# Altium project AMX3.PrjPCB
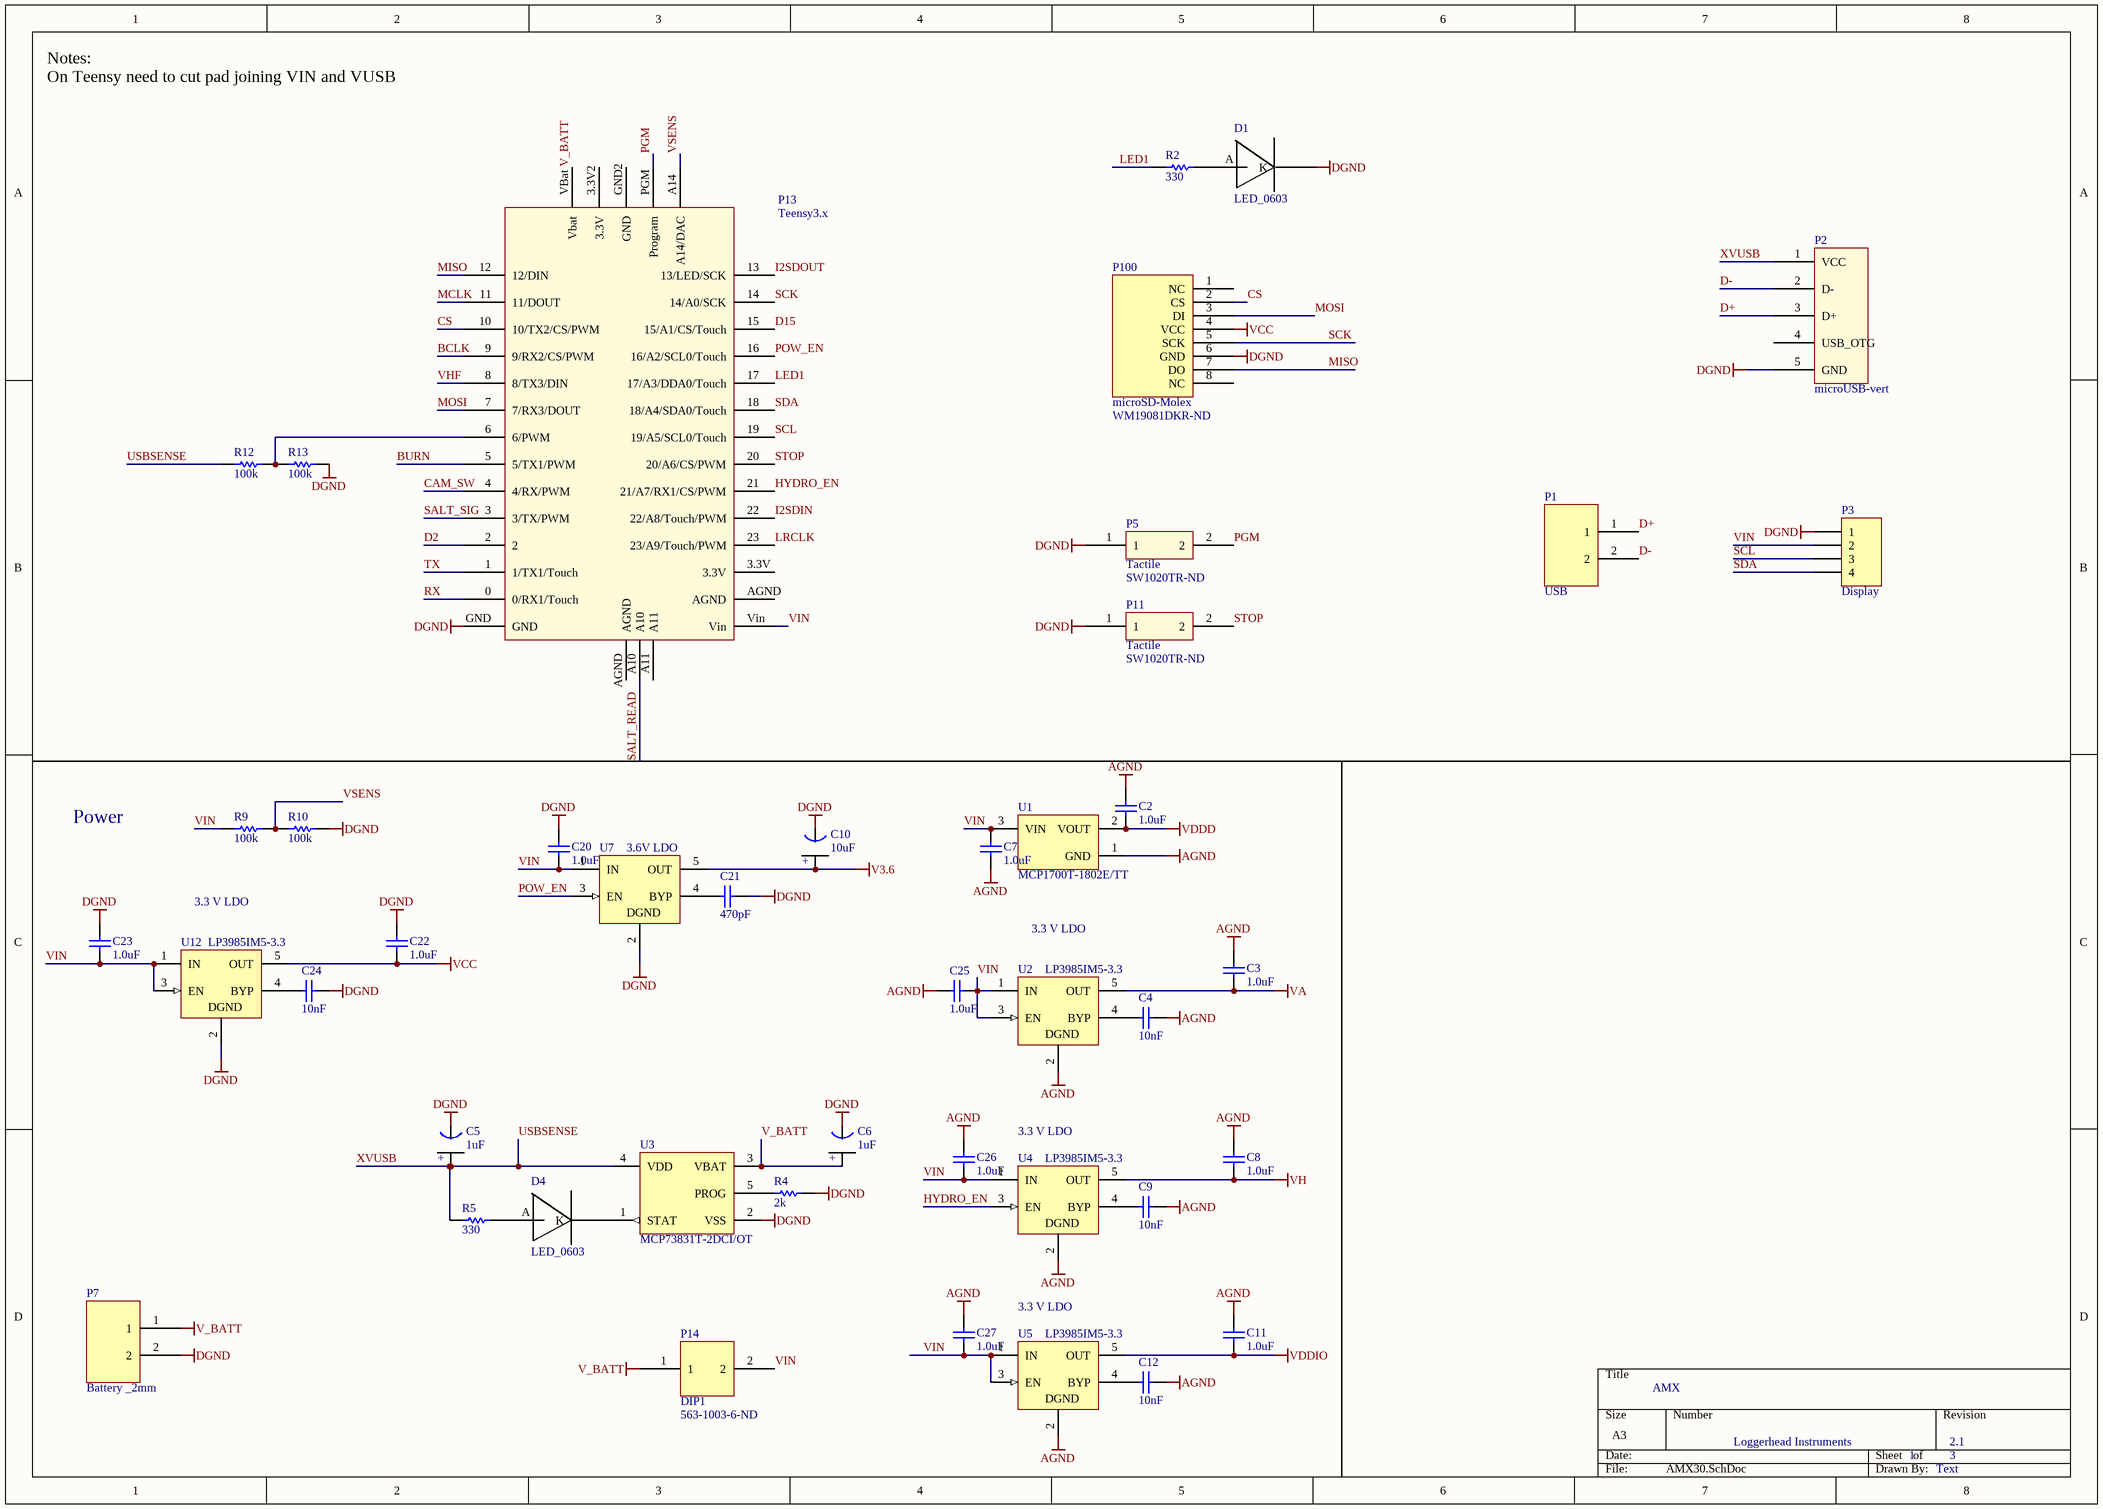
[diagram p0: AMX30.SchDoc]
3 sheets, 78 parts. Net scope: global (net labels, ports and power ports of the same name join across sheets).
Board file: AMX_v30.PcbDoc
Sheets:
  AMX30.SchDoc
  AMX_sensors30.SchDoc
  AMX_audio30.SchDoc

## Sheet AMX30.SchDoc
size A3

### Parts
C2  1.0uF  [0402]
C3  1.0uF  [0402]
C4  10nF  [0402]
C5  1uF  [Tant0805]
C6  1uF  [Tant0805]
C7  1.0uF  [0402]
C8  1.0uF  [0402]
C9  10nF  [0402]
C10  10uF  [Tant0805]
C11  1.0uF  [0402]
C12  10nF  [0402]
C20  1.0uF  [0402]
C21  470pF  [0402]
C22  1.0uF  [0402]
C23  1.0uF  [0402]
C24  10nF  [0402]
C25  1.0uF  [0402]
C26  1.0uF  [0402]
C27  1.0uF  [0402]
D1  LED_0603  [Diode0603]
D4  LED_0603  [Diode0603]
P1  USB  [HDR_2x1_2mm]
P2  microUSB-vert  [MICROUSB-VERT]
P3  Display  [HDR1X4]
P5  Tactile  Supplier Part Number 1: SW1020TR-ND  [Tactile-B3U-1000]
P7  Battery _2mm  [HDR_2x1_2mm]
P11  Tactile  Supplier Part Number 1: SW1020TR-ND  [Tactile-B3U-1000]
P13  Teensy3.x  [Teensy3.x]
P14  DIP1  Supplier Part Number 1: 563-1003-6-ND  [DIP1]
P100  microSD-Molex  Supplier Part Number 1: WM19081DKR-ND  [microSD_Molex_hinged]
R2  330  [3-0603]
R4  2k  [3-0603]
R5  330  [3-0603]
R9  100k  [3-0603]
R10  100k  [3-0603]
R12  100k  [3-0603]
R13  100k  [3-0603]
U1  MCP1700T-1802E/TT  [SOT-23-TT3_N]
U2  LP3985IM5-3.3  [MF05A_N]
U3  MCP73831T-2DCI/OT  [SOT-23-OT5_N]
U4  LP3985IM5-3.3  [MF05A_N]
U5  LP3985IM5-3.3  [MF05A_N]
U7  3.6V LDO  [MF05A_N]
U12  LP3985IM5-3.3  [MF05A_N]

### Nets
AGND: C2.2 C3.2 C4.1 C7.2 C8.2 C9.1 C11.2 C12.1 C25.2 C26.2 C27.2 U1.1(GND) U2.2(GND) U4.2(GND) U5.2(GND)
DGND: C5.1(GND) C6.1(GND) C10.1(GND) C20.2 C21.1 C22.2 C23.2 C24.1 D1.K P2.5(GND) P3.1 P5.1 P7.2 P11.1 P13.GND P100.6(GND) R4.1 R10.1 R13.2 U3.2(VSS) U7.2(GND) U12.2(GND)
V3.6: C10.2(+) U7.5(OUT)
V_BATT: C6.2(+) P7.1 P13.VBat(Vbat) P14.1 U3.3(VBAT)
VA: C3.1 U2.5(OUT)
VCC: C22.1 P100.4(VCC) U12.5(OUT)
VDDD: C2.1 U1.2(VOUT)
VDDIO: C11.1 U5.5(OUT)
VH: C8.1 U4.5(OUT)
BCLK: P13.9(9/RX2/CS/PWM)
BURN: P13.5(5/TX1/PWM)
CAM_SW: P13.4(4/RX/PWM)
CS: P13.10(10/TX2/CS/PWM) P100.2(CS)
D2: P13.2
D15: P13.15(15/A1/CS/Touch)
D+: P1.1 P2.3(D+)
D-: P1.2 P2.2(D-)
HYDRO_EN: P13.21(21/A7/RX1/CS/PWM) U4.3(EN)
I2SDIN: P13.22(22/A8/Touch/PWM)
I2SDOUT: P13.13(13/LED/SCK)
LED1: P13.17(17/A3/DDA0/Touch) R2.1
LRCLK: P13.23(23/A9/Touch/PWM)
MCLK: P13.11(11/DOUT)
MISO: P13.12(12/DIN) P100.7(DO)
MOSI: P13.7(7/RX3/DOUT) P100.3(DI)
PGM: P5.2 P13.PGM(Program)
POW_EN: P13.16(16/A2/SCL0/Touch) U7.3(EN)
RX: P13.0(0/RX1/Touch)
SALT_READ: P13.A10
SALT_SIG: P13.3(3/TX/PWM)
SCK: P13.14(14/A0/SCK) P100.5(SCK)
SCL: P3.3 P13.19(19/A5/SCL0/Touch)
SDA: P3.4 P13.18(18/A4/SDA0/Touch)
STOP: P11.2 P13.20(20/A6/CS/PWM)
TX: P13.1(1/TX1/Touch)
USBSENSE: C5.2(+) P2.1(VCC) R5.1 R12.1 U3.4(VDD)  [also labelled XVUSB]
VHF: P13.8(8/TX3/DIN)
VIN: C7.1 C20.1 C23.1 C25.1 C26.1 C27.1 P3.2 P13.Vin P14.2 R9.2 U1.3(VIN) U2.1(IN) U2.3(EN) U4.1(IN) U5.1(IN) U5.3(EN) U7.1(IN) U12.1(IN) U12.3(EN)
VSENS: P13.A14(A14/DAC) R9.1 R10.2
NetC4_2: C4.2 U2.4(BYP)
NetC9_2: C9.2 U4.4(BYP)
NetC12_2: C12.2 U5.4(BYP)
NetC21_2: C21.2 U7.4(BYP)
NetC24_2: C24.2 U12.4(BYP)
NetD1_A: D1.A R2.2
NetD4_A: D4.A R5.2
NetD4_K: D4.K U3.1(STAT)
NetP13_6: P13.6(6/PWM) R12.2 R13.1
NetR4_2: R4.2 U3.5(PROG)

Not connected (* = marked no-connect by the designer): P2 4(USB_OTG); P13 3.3V 3.3V2(3.3V) A11 AGND GND2(GND); P100 1(NC) 8(NC)

### Notes on the sheet
- Notes:
  On Teensy need to cut pad joining VIN and VUSB
- Power
- 3.3 V LDO
- AMX
- Loggerhead Instruments
- 1
- 2.1
- 3
- Text
- (in symbol LP3985IM5-3.3) DGND

### Library data of the parts
C2-C4 C7-C9 C11 C12 C20-C27 = C0402: Ceramic Chip Capacitor - Standard; Note: Footprint corresponds to dimensions for bulk cassette packaging. This case size has tightened tolerances.; Value: 0.1uF; Published: 17-Jul-2002; LatestRevisionDate: 19-Mar-2004; LatestRevisionNote: Silkscreen size reduced.; DatasheetDocument: Mar-2001; PackageDocument: Mar-2001; PackageReference: 0402; Publisher: Altium Limited; Code_JEITA: 0402; Code_IPC: 1005 [0402]; ComponentLink1Description: Manufacturer Link; ComponentLink1URL: http://www.kemet.com/; ComponentLink2Description: Datasheet; ComponentLink2URL: http://www.kemet.com/kemet/web/homepage/kechome.nsf/vapubfilesname/F3102TA.pdf/$file/F3102TA.pdf
C5 C6 = Tant0805: Value: 1uF
C10 = Tant0805: Value: 1uF
P1 P7 = HDR_2x1_2mm: Charging Connector
P2 = microUSB-vert: Molex 105133-0011
P3 = Header 4: Header, 4-Pin; LatestRevisionDate: 17-Jul-2002; LatestRevisionNote: Re-released for DXP Platform.; Publisher: Altium Limited
P5 P11 = Tactile_B3U-1000: Supplier 1: Digi-Key
P100 = microSD_Molex_hinged: Supplier 1: Digi-Key
R2 R4 R5 R9 R10 R12 R13 = ERJ3RK: Precision Thick Film Chip Resistor, 10 Ohm to 1M Ohm Range, 1% and 0.5% Tolerance, 0603 Size, 0.063 W; Published: 17-Dec-2003; LatestRevisionDate: 19-Mar-2004; LatestRevisionNote: Silkscreen size reduced.; PackageDocument: Mar-2003; PackageReference: 3-0603; Publisher: Altium Limited; Code_IPC: 1608 [0603]; ComponentLink1Description: Manufacturer Link; ComponentLink1URL: http://www.panasonic.com/industrial/components/resistive_products.htm; ComponentLink2Description: Datasheet; ComponentLink2URL: http://www.panasonic.com/industrial/components/pdf/AOA0000CE2.pdf
U1 = MCP1700T-1802E/TT: Low Quiescent Current LDO, 3-Pin SOT-23, Extended Temperature, Tape and Reel; Manufacturer: Microchip; DatasheetVersion: revB, Feb-2007; PackageVersion: revBB, Aug-2009; PackageReference: SOT-23-TT3; PackageDescription: 3-Lead Plastic Small Outline Transistor (TT) [SOT-23]; Supplier 1: Digi-Key; Supplier Part Number 1: MCP1700T1802ETTTR-ND; Supplier 2: Digi-Key; Supplier Part Number 2: MCP1700T1802ETTCT-ND; Supplier 3: Digi-Key; Supplier Part Number 3: MCP1700T1802ETTDKR-ND; Supplier 4: Farnell; Supplier Part Number 4: 1296591RL; Supplier 5: Farnell; Supplier Part Number 5: 1296591; Supplier 6: Newark; Supplier Part Number 6: 84R5175; Supplier 7: Mouser; Supplier Part Number 7: 579-MCP1700T1802E/TT; Mounting Technology: Surface Mount; Code_IPC: SOT23-3; PartNumber: MCP1700T-1802E/TT; ComponentLink1Description: Manufacturer URL; ComponentLink1URL: http://www.microchip.com/; ComponentLink2Description: Datasheet; ComponentLink2URL: http://ww1.microchip.com/downloads/en/DeviceDoc/21826b.pdf; ComponentLink3Description: Package Specification; ComponentLink3URL: http://www.microchip.com/stellent/groups/techpub_sg/documents/packagingspec/en012702.pdf
U2 U4 U5 U7 U12 = LP3985IM5-3.3: Micropower, 150mA Low-Noise Ultra Low-Dropout CMOS Voltage Regulator; Manufacturer: National Semiconductor; CompType: LDO IC; PackageTopMarking: LDQB*XTT; PowerWise: N; Published: 4-Dec-2008; DatasheetVersion: Aug-2005; PackageVersion: revD, Aug-2008; PackageReference: MF05A; Publisher: Altium Limited; PackageDescription: Molded SOT-23, .115 x .063 x .040 in Body, 5 Lead, .0375 in Pitch; PartNumber: LP3985IM5-3.3; RoHS: O; PinCount: 5; DigiKeyPartNumber: LP3985IM5-3.3CT-ND; ComponentLink1Description: LP3985 Datasheet; ComponentLink1URL: http://www.national.com/ds/LP/LP3985.pdf; ComponentLink2Description: LP3985 Web Page; ComponentLink2URL: http://www.national.com/pf/LP/LP3985.html; ComponentLink3Description: MF05A Package Page; ComponentLink3URL: http://www.national.com/packaging/folders/mf05a.html
U3 = MCP73831T-2DCI/OT: Miniature Single-Cell, Fully Integrated Li-Ion, Li-Polymer Charge Management Controller, 4.2V, 5-Pin SOT-23, Industrial Temperature, Tape and Reel; DatasheetVersion: revE, Sep-2008; PackageVersion: revBB, Aug-2009; PackageReference: SOT-23-OT5; PackageDescription: 5-Lead Plastic Small Outline Transistor (OT) [SOT-23]; Code_IPC: SOT23-5; ComponentLink1Description: Manufacturer URL; ComponentLink1URL: http://www.microchip.com/; ComponentLink2Description: Datasheet; ComponentLink2URL: http://ww1.microchip.com/downloads/en/DeviceDoc/21984e.pdf; ComponentLink3Description: Package Specification; ComponentLink3URL: http://www.microchip.com/stellent/groups/techpub_sg/documents/packagingspec/en012702.pdf
P14 = DIP1: Supplier 1: Digi-Key

## Sheet AMX_sensors30.SchDoc
size A
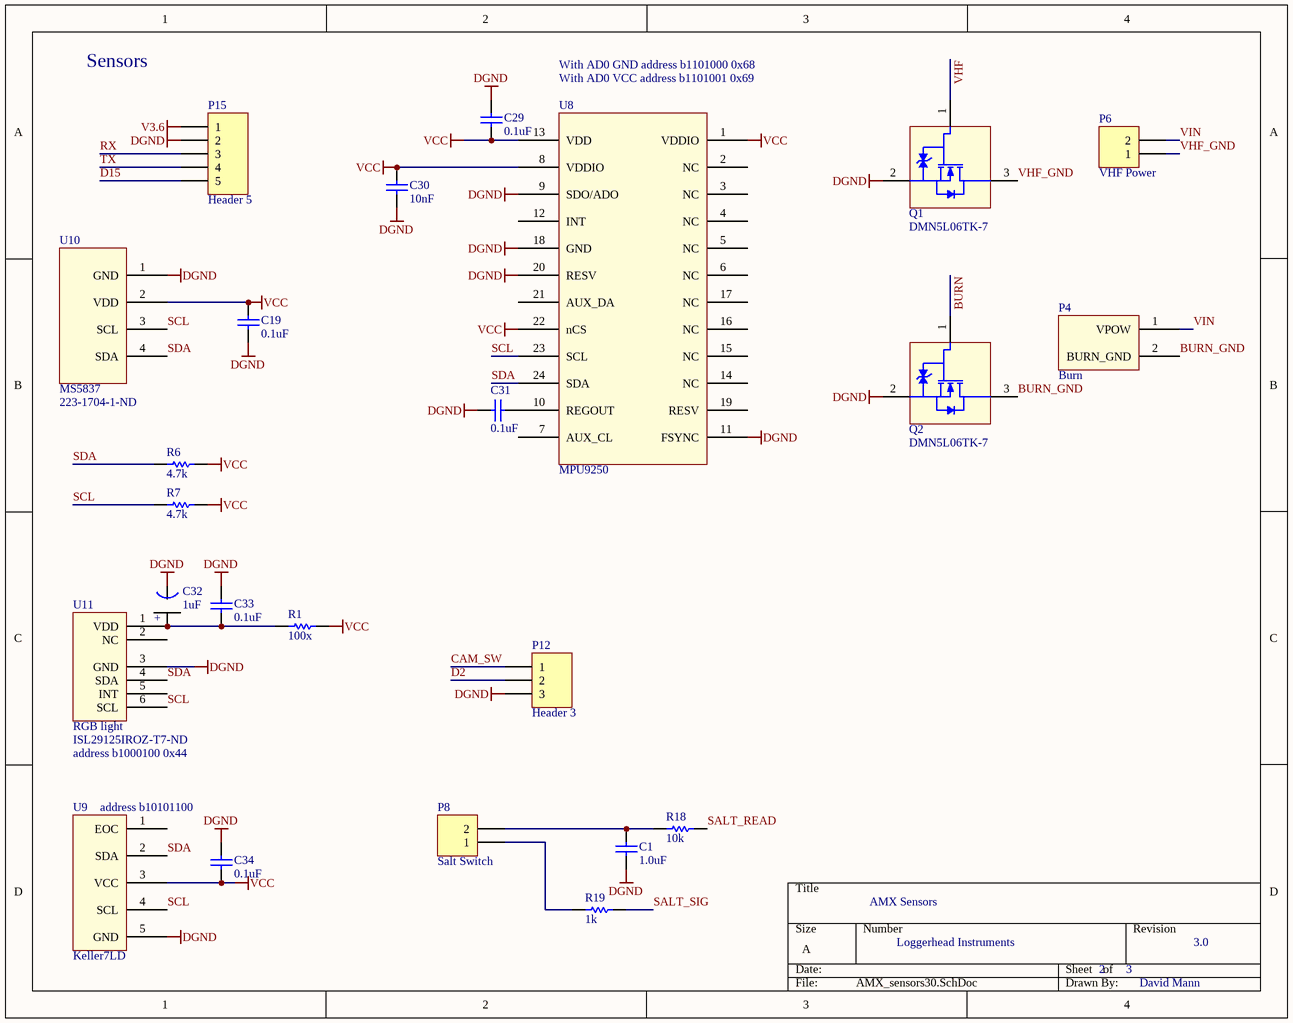
[diagram p1: AMX_sensors30.SchDoc]

### Parts
C1  1.0uF  [0402]
C19  0.1uF  [0402]
C29  0.1uF  [0402]
C30  10nF  [0402]
C31  0.1uF  [0402]
C32  1uF  [Tant0805]
C33  0.1uF  [0402]
C34  0.1uF  [0402]
P4  Burn  [BURN]
P6  VHF Power  [HDR1X2]
P8  Salt Switch  [HDR1X2]
P12  Header 3  [HDR1X3]
P15  Header 5  [HDR1X5]
Q1  DMN5L06TK-7  [SOT-523]
Q2  DMN5L06TK-7  [SOT-523]
R1  100x  [3-0603]
R6  4.7k  [3-0603]
R7  4.7k  [3-0603]
R18  10k  [3-0603]
R19  1k  [3-0603]
U8  MPU9250  [MPU6500]
U9  Keller7LD  [Keller7LD]
U10  MS5837  Supplier Part Number 1: 223-1704-1-ND  [MS5837]
U11  RGB light  Supplier Part Number 1: ISL29125IROZ-T7-ND  [ODFN]

### Nets
DGND: C1.2 C19.1 C29.2 C30.2 C31.1 C32.1(GND) C33.2 C34.2 P12.3 P15.2 Q1.2(S) Q2.2(S) U8.9(SDO/ADO) U8.11(FSYNC) U8.18(GND) U8.20(RESV) U9.5(GND) U10.1(GND) U11.3(GND)
V3.6: P15.1
VCC: C19.2 C29.1 C30.1 C34.1 R1.1 R6.1 R7.2 U8.1(VDDIO) U8.8(VDDIO) U8.13(VDD) U8.22(nCS) U9.3(VCC) U10.2(VDD)
BURN: Q2.1(G)
BURN_GND: P4.2(BURN_GND) Q2.3(D)
CAM_SW: P12.1
D2: P12.2
D15: P15.5
RX: P15.3
SALT_READ: R18.1
SALT_SIG: R19.2
SCL: R7.1 U8.23(SCL) U9.4(SCL) U10.3(SCL) U11.6(SCL)
SDA: R6.2 U8.24(SDA) U9.2(SDA) U10.4(SDA) U11.4(SDA)
TX: P15.4
VHF: Q1.1(G)
VHF_GND: P6.1 Q1.3(D)
VIN: P4.1(VPOW) P6.2
NetC1_1: C1.1 P8.2 R18.2
NetC31_2: C31.2 U8.10(REGOUT)
NetC32_2: C32.2(+) C33.1 R1.2 U11.1(VDD)
NetP8_1: P8.1 R19.1

Not connected (* = marked no-connect by the designer): U8 2(NC) 3(NC) 4(NC) 5(NC) 6(NC) 7(AUX_CL) 12(INT) 14(NC) 15(NC) 16(NC) 17(NC) 19(RESV) 21(AUX_DA); U9 1(EOC); U11 2(NC) 5(INT)

### Notes on the sheet
- Sensors
- With AD0 GND address b1101000 0x68
- With AD0 VCC address b1101001 0x69
- (near U11) address b1000100 0x44
- (near U9) address b10101100
- AMX Sensors
- Loggerhead Instruments
- 2
- 3
- 3.0
- David Mann

### Library data of the parts
C1 = C0402: as C2 on sheet AMX30; Published: 17-Jul-2002; LatestRevisionDate: 19-Mar-2004; LatestRevisionNote: Silkscreen size reduced.; DatasheetDocument: Mar-2001; PackageDocument: Mar-2001; PackageReference: 0402; Publisher: Altium Limited; Code_JEITA: 0402; Code_IPC: 1005 [0402]; ComponentLink1Description: Manufacturer Link; ComponentLink1URL: http://www.kemet.com/; ComponentLink2Description: Datasheet; ComponentLink2URL: http://www.kemet.com/kemet/web/homepage/kechome.nsf/vapubfilesname/F3102TA.pdf/$file/F3102TA.pdf
C19 C29-C31 C33 C34 = C0402: Ceramic Chip Capacitor - Standard; Note: Footprint corresponds to dimensions for bulk cassette packaging. This case size has tightened tolerances.; Published: 17-Jul-2002; LatestRevisionDate: 19-Mar-2004; LatestRevisionNote: Silkscreen size reduced.; DatasheetDocument: Mar-2001; PackageDocument: Mar-2001; PackageReference: 0402; Publisher: Altium Limited; Code_JEITA: 0402; Code_IPC: 1005 [0402]; ComponentLink1Description: Manufacturer Link; ComponentLink1URL: http://www.kemet.com/; ComponentLink2Description: Datasheet; ComponentLink2URL: http://www.kemet.com/kemet/web/homepage/kechome.nsf/vapubfilesname/F3102TA.pdf/$file/F3102TA.pdf
  C19 C29 C31 C33 C34: Value: 0.1uF
  C30: Value: 10nF
C32 = Tant0805: Value: 1uF
P4 = Burn Screw
P6 P8 = Header 2: Header, 2-Pin; LatestRevisionDate: 17-Jul-2002; LatestRevisionNote: Re-released for DXP Platform.; Publisher: Altium Limited
P12 = Header 3: Header, 3-Pin; LatestRevisionDate: 17-Jul-2002; LatestRevisionNote: Re-released for DXP Platform.; Publisher: Altium Limited
P15 = Header 5: Header, 5-Pin; LatestRevisionDate: 17-Jul-2002; LatestRevisionNote: Re-released for DXP Platform.; Publisher: Altium Limited
Q1 Q2 = FET DMN5L06TK-7: Ultra-low leakage Enhanced MOSFET; Fabrication Tested: NO; Creator and Date: Will Flanery 2010-09-02; Footprint Verified By: *; Schematic Verified By: *; Vendor Info Verified By: *; Supplier 1: Digi-Key; Supplier Part Number 1: DMN5L06TKDICT-ND; HelpURL: http://www.diodes.com/datasheets/ds30926.pdf
R1 R6 R7 R18 R19 = ERJ3RK: as R2 on sheet AMX30; Published: 17-Dec-2003; LatestRevisionDate: 19-Mar-2004; LatestRevisionNote: Silkscreen size reduced.; PackageDocument: Mar-2003; PackageReference: 3-0603; Publisher: Altium Limited; Code_IPC: 1608 [0603]; ComponentLink1Description: Manufacturer Link; ComponentLink1URL: http://www.panasonic.com/industrial/components/resistive_products.htm; ComponentLink2Description: Datasheet; ComponentLink2URL: http://www.panasonic.com/industrial/components/pdf/AOA0000CE2.pdf
U8 = MPU-9250: Invensense
U9 = Keller 7LD: Keller Pressure/Temp; PDF: http://www.kelleramerica.com/pdf-library/Piezoresistive%20OEM%20Pressure%20Transmitters%20with%20I2C%20interface%20and%20embedded%20signal%20conditioning.pdf
U10 = MS5837: Pressure/Temp; Supplier 1: Digi-Key
U11 = ISL29125: RGB light sensor; Supplier 1: Digi-Key

## Sheet AMX_audio30.SchDoc
size A
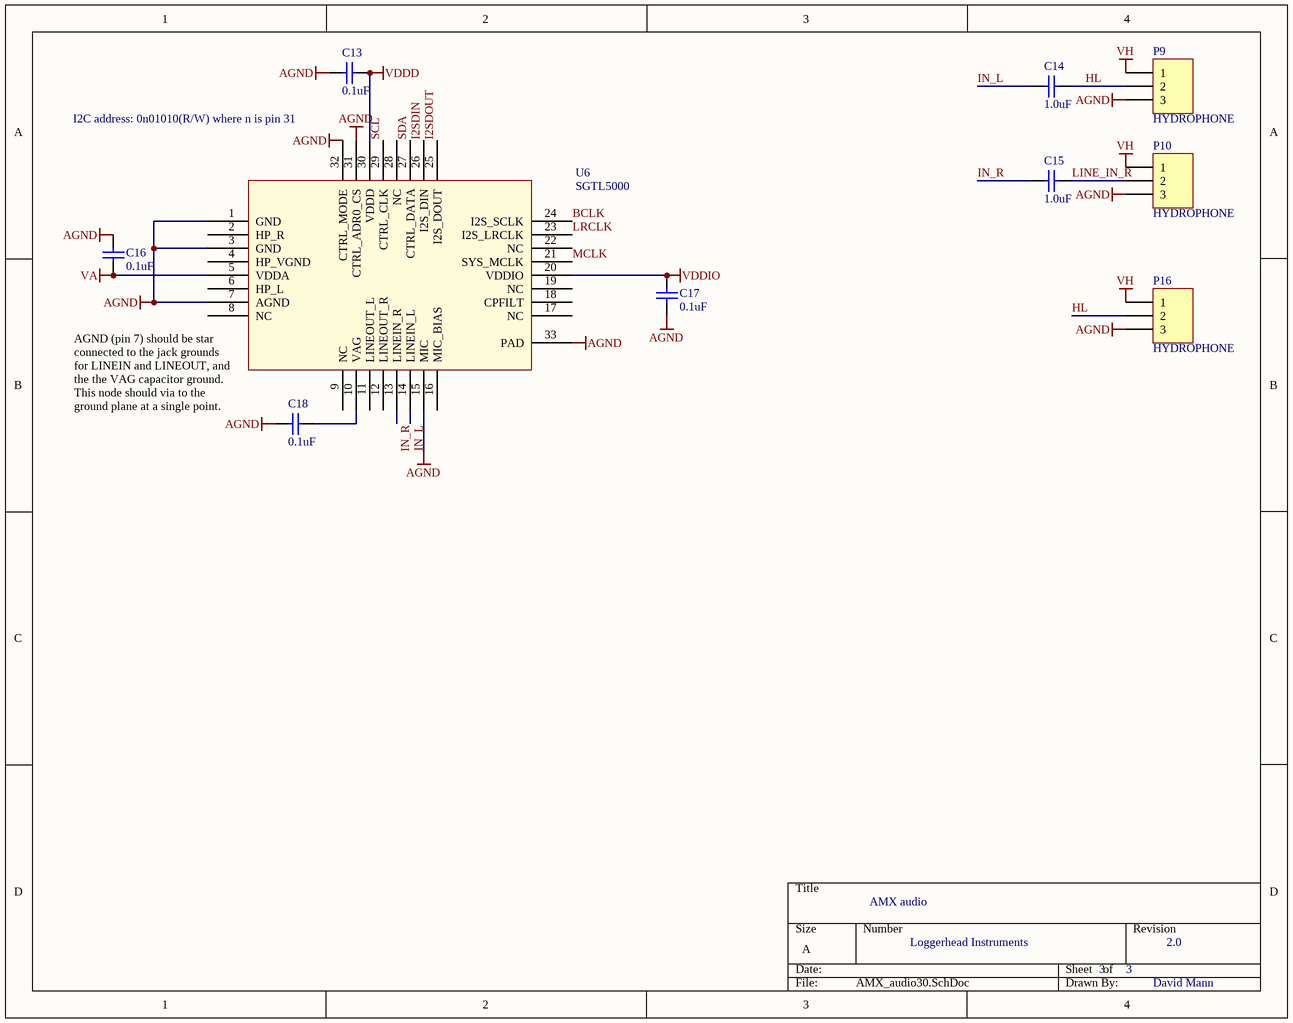
[diagram p2: AMX_audio30.SchDoc]

### Parts
C13  0.1uF  [0402]
C14  1.0uF  [0402]
C15  1.0uF  [0402]
C16  0.1uF  [0402]
C17  0.1uF  [0402]
C18  0.1uF  [0402]
P9  HYDROPHONE  [HDR1X3]
P10  HYDROPHONE  [HDR1X3]
P16  HYDROPHONE  [HDR1X3]
U6  SGTL5000  [QFN32]

### Nets
AGND: C13.2 C16.2 C17.2 C18.2 P9.3 P10.3 P16.3 U6.1(GND) U6.3(GND) U6.7(AGND) U6.15(MIC) U6.31(CTRL_ADR0_CS) U6.32(CTRL_MODE) U6.33(PAD)
VA: C16.1 U6.5(VDDA)
VDDD: C13.1 U6.30(VDDD)
VDDIO: C17.1 U6.20(VDDIO)
VH: P9.1 P10.1 P16.1
BCLK: U6.24(I2S_SCLK)
HL: C14.1 P9.2 P16.2
I2SDIN: U6.26(I2S_DIN)
I2SDOUT: U6.25(I2S_DOUT)
IN_L: C14.2 U6.14(LINEIN_L)
IN_R: C15.2 U6.13(LINEIN_R)
LINE_IN_R: C15.1 P10.2
LRCLK: U6.23(I2S_LRCLK)
MCLK: U6.21(SYS_MCLK)
SCL: U6.29(CTRL_CLK)
SDA: U6.27(CTRL_DATA)
NetC18_1: C18.1 U6.10(VAG)

Not connected (* = marked no-connect by the designer): U6 2(HP_R) 4(HP_VGND) 6(HP_L) 8(NC) 9(NC) 11(LINEOUT_L) 12(LINEOUT_R) 16(MIC_BIAS) 17(NC) 18(CPFILT) 19(NC) 22(NC) 28(NC)

### Notes on the sheet
- I2C address: 0n01010(R/W) where n is pin 31
- (near U6) AGND (pin 7) should be star connected to the jack grounds for LINEIN and LINEOUT, and the the VAG capacitor ground. This node should via to the ground plane at a single point.
- AMX audio
- Loggerhead Instruments
- 3
- 2.0
- David Mann

### Library data of the parts
C13 C16-C18 = C0402: as C19 on sheet AMX_sensors30; Published: 17-Jul-2002; LatestRevisionDate: 19-Mar-2004; LatestRevisionNote: Silkscreen size reduced.; DatasheetDocument: Mar-2001; PackageDocument: Mar-2001; PackageReference: 0402; Publisher: Altium Limited; Code_JEITA: 0402; Code_IPC: 1005 [0402]; ComponentLink1Description: Manufacturer Link; ComponentLink1URL: http://www.kemet.com/; ComponentLink2Description: Datasheet; ComponentLink2URL: http://www.kemet.com/kemet/web/homepage/kechome.nsf/vapubfilesname/F3102TA.pdf/$file/F3102TA.pdf; Value: 0.1uF
C14 C15 = C0402: as C2 on sheet AMX30; Published: 17-Jul-2002; LatestRevisionDate: 19-Mar-2004; LatestRevisionNote: Silkscreen size reduced.; DatasheetDocument: Mar-2001; PackageDocument: Mar-2001; PackageReference: 0402; Publisher: Altium Limited; Code_JEITA: 0402; Code_IPC: 1005 [0402]; ComponentLink1Description: Manufacturer Link; ComponentLink1URL: http://www.kemet.com/; ComponentLink2Description: Datasheet; ComponentLink2URL: http://www.kemet.com/kemet/web/homepage/kechome.nsf/vapubfilesname/F3102TA.pdf/$file/F3102TA.pdf
P9 P10 P16 = Header 3: Header, 3-Pin; LatestRevisionDate: 17-Jul-2002; LatestRevisionNote: Re-released for DXP Platform.; Publisher: Altium Limited

## Nets that join several sheets
AGND: AMX30 (15 pins), AMX_audio30 (14 pins)
DGND: AMX30 (22 pins), AMX_sensors30 (19 pins)
V3.6: AMX30 (C10.2 U7.5), AMX_sensors30 (P15.1)
VA: AMX30 (C3.1 U2.5), AMX_audio30 (C16.1 U6.5)
VCC: AMX30 (C22.1 P100.4 U12.5), AMX_sensors30 (13 pins)
VDDD: AMX30 (C2.1 U1.2), AMX_audio30 (C13.1 U6.30)
VDDIO: AMX30 (C11.1 U5.5), AMX_audio30 (C17.1 U6.20)
VH: AMX30 (C8.1 U4.5), AMX_audio30 (P9.1 P10.1 P16.1)
BCLK: AMX30 (P13.9), AMX_audio30 (U6.24)
BURN: AMX30 (P13.5), AMX_sensors30 (Q2.1)
CAM_SW: AMX30 (P13.4), AMX_sensors30 (P12.1)
D2: AMX30 (P13.2), AMX_sensors30 (P12.2)
D15: AMX30 (P13.15), AMX_sensors30 (P15.5)
I2SDIN: AMX30 (P13.22), AMX_audio30 (U6.26)
I2SDOUT: AMX30 (P13.13), AMX_audio30 (U6.25)
LRCLK: AMX30 (P13.23), AMX_audio30 (U6.23)
MCLK: AMX30 (P13.11), AMX_audio30 (U6.21)
RX: AMX30 (P13.0), AMX_sensors30 (P15.3)
SALT_READ: AMX30 (P13.A10), AMX_sensors30 (R18.1)
SALT_SIG: AMX30 (P13.3), AMX_sensors30 (R19.2)
SCL: AMX30 (P3.3 P13.19), AMX_sensors30 (5 pins), AMX_audio30 (U6.29)
SDA: AMX30 (P3.4 P13.18), AMX_sensors30 (5 pins), AMX_audio30 (U6.27)
TX: AMX30 (P13.1), AMX_sensors30 (P15.4)
VHF: AMX30 (P13.8), AMX_sensors30 (Q1.1)
VIN: AMX30 (19 pins), AMX_sensors30 (P4.1 P6.2)